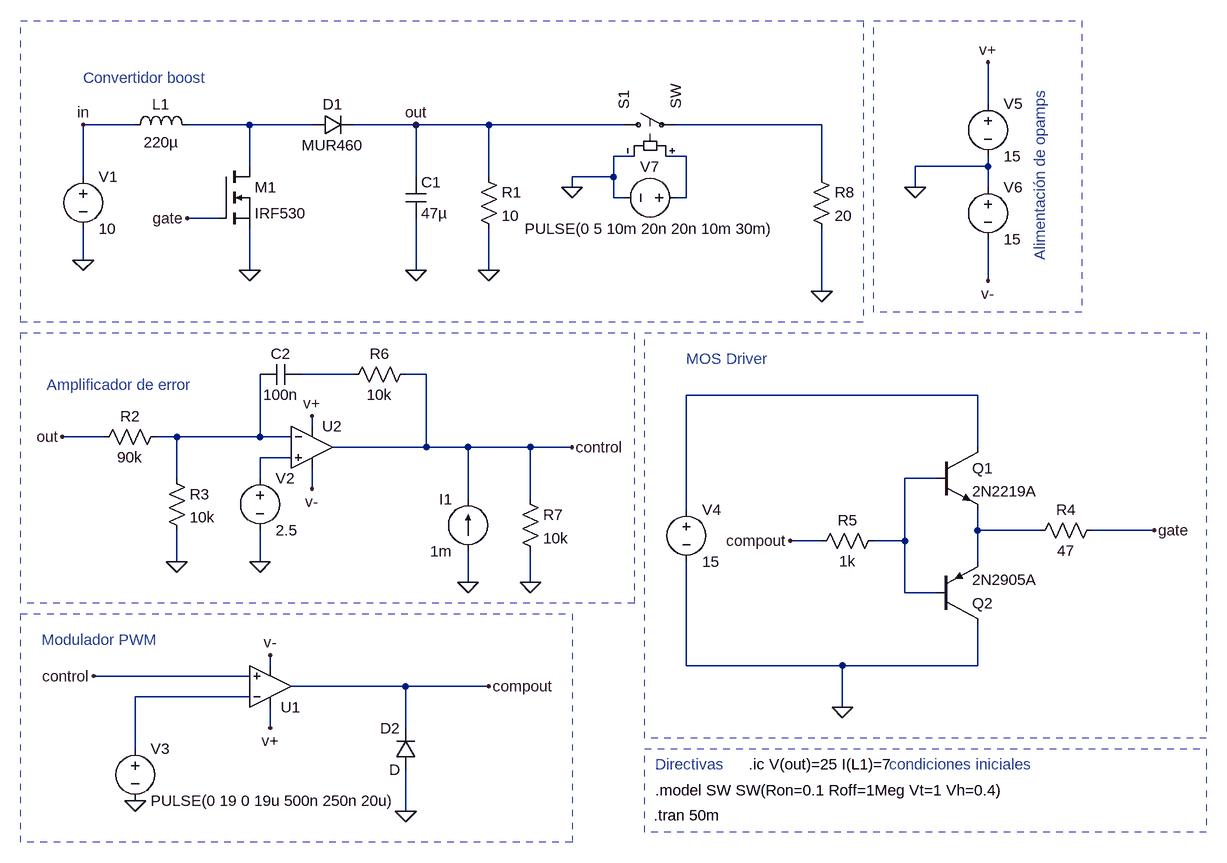
[diagram p0: schematic e4-tp2-ej1.asc]
e4-tp2-ej1.asc, the LTspice schematic file:
Version 4
SHEET 1 920 1444
WIRE 512 -384 512 -448
WIRE -800 -352 -880 -352
WIRE -624 -352 -720 -352
WIRE -528 -352 -624 -352
WIRE -368 -352 -464 -352
WIRE -256 -352 -368 -352
WIRE -48 -352 -256 -352
WIRE 256 -352 32 -352
WIRE -32 -304 -64 -304
WIRE 48 -304 16 -304
WIRE -624 -288 -624 -352
WIRE 512 -288 512 -304
WIRE 512 -288 400 -288
WIRE -880 -272 -880 -352
WIRE -368 -272 -368 -352
WIRE -256 -272 -256 -352
WIRE -64 -272 -64 -304
WIRE -64 -272 -128 -272
WIRE 256 -272 256 -352
WIRE -128 -256 -128 -272
WIRE 400 -256 400 -288
WIRE 512 -256 512 -288
WIRE -64 -240 -64 -272
WIRE -48 -240 -64 -240
WIRE 48 -240 48 -304
WIRE 48 -240 32 -240
WIRE -672 -208 -720 -208
WIRE -880 -144 -880 -192
WIRE -624 -128 -624 -192
WIRE -368 -128 -368 -208
WIRE -256 -128 -256 -192
WIRE 512 -112 512 -176
WIRE 256 -96 256 -192
WIRE -464 32 -544 32
WIRE -352 32 -384 32
WIRE 496 64 48 64
WIRE -528 112 -528 96
WIRE -848 128 -912 128
WIRE -736 128 -768 128
WIRE -608 128 -608 32
WIRE -608 128 -736 128
WIRE -560 128 -608 128
WIRE -352 144 -352 32
WIRE -352 144 -496 144
WIRE -288 144 -352 144
WIRE -192 144 -288 144
WIRE -128 144 -192 144
WIRE 496 144 496 64
WIRE -560 160 -608 160
WIRE -736 192 -736 128
WIRE -608 192 -608 160
WIRE 432 192 384 192
WIRE -528 208 -528 176
WIRE -288 224 -288 144
WIRE -192 224 -192 144
WIRE 48 240 48 64
WIRE 496 272 496 240
WIRE 592 272 496 272
WIRE 768 272 672 272
WIRE 256 288 208 288
WIRE 384 288 384 192
WIRE 384 288 336 288
WIRE -736 320 -736 272
WIRE -608 320 -608 272
WIRE 496 320 496 272
WIRE -288 352 -288 304
WIRE -192 352 -192 304
WIRE 384 368 384 288
WIRE 432 368 384 368
WIRE -592 480 -592 464
WIRE 48 480 48 320
WIRE 288 480 48 480
WIRE 496 480 496 416
WIRE 496 480 288 480
WIRE -624 496 -864 496
WIRE -384 512 -560 512
WIRE -256 512 -384 512
WIRE -624 528 -800 528
WIRE 288 544 288 480
WIRE -592 576 -592 544
WIRE -384 576 -384 512
WIRE -800 608 -800 528
WIRE -384 704 -384 640
FLAG -800 688 0
FLAG -880 -144 0
FLAG -368 -128 0
FLAG -256 -128 0
FLAG -368 -352 out
FLAG -880 -352 in
FLAG -912 128 out
FLAG -736 320 0
FLAG -608 320 0
FLAG -288 352 0
FLAG -192 352 0
FLAG -128 144 control
FLAG -624 -128 0
FLAG -720 -208 gate
FLAG -384 704 0
FLAG -864 496 control
FLAG -256 512 compout
FLAG 208 288 compout
FLAG 288 544 0
FLAG 768 272 gate
FLAG 256 -96 0
FLAG 400 -256 0
FLAG 512 -448 v+
FLAG 512 -112 v-
FLAG -592 464 v-
FLAG -528 208 v-
FLAG -528 96 v+
FLAG -592 576 v+
FLAG -128 -256 0
SYMBOL voltage -800 592 R0
WINDOW 123 0 0 Left 0
WINDOW 39 0 0 Left 0
SYMATTR InstName V3
SYMATTR Value PULSE(0 19 0 19u 500n 250n 20u)
SYMBOL voltage -880 -288 R0
WINDOW 123 0 0 Left 0
WINDOW 39 0 0 Left 0
SYMATTR InstName V1
SYMATTR Value 10
SYMBOL ind -816 -336 R270
WINDOW 0 32 56 VTop 2
WINDOW 3 5 56 VBottom 2
SYMATTR InstName L1
SYMATTR Value 220µ
SYMBOL cap -384 -272 R0
SYMATTR InstName C1
SYMATTR Value 47µ
SYMBOL nmos -672 -288 R0
SYMATTR InstName M1
SYMATTR Value IRF530
SYMBOL res -272 -288 R0
SYMATTR InstName R1
SYMATTR Value 10
SYMBOL sw -64 -352 R270
SYMATTR InstName S1
SYMBOL res -752 112 R90
WINDOW 0 0 56 VBottom 2
WINDOW 3 32 56 VTop 2
SYMATTR InstName R2
SYMATTR Value 90k
SYMBOL res -752 176 R0
SYMATTR InstName R3
SYMATTR Value 10k
SYMBOL voltage -608 176 R0
WINDOW 123 0 0 Left 0
WINDOW 39 0 0 Left 0
SYMATTR InstName V2
SYMATTR Value 2.5
SYMBOL res -368 16 R90
WINDOW 0 0 56 VBottom 2
WINDOW 3 32 56 VTop 2
SYMATTR InstName R6
SYMATTR Value 10k
SYMBOL cap -544 16 R90
WINDOW 0 0 32 VBottom 2
WINDOW 3 32 32 VTop 2
SYMATTR InstName C2
SYMATTR Value 100n
SYMBOL res -208 208 R0
SYMATTR InstName R7
SYMATTR Value 10k
SYMBOL current -288 304 R180
WINDOW 0 24 80 Left 2
WINDOW 3 24 0 Left 2
WINDOW 123 0 0 Left 0
WINDOW 39 0 0 Left 0
SYMATTR InstName I1
SYMATTR Value 1m
SYMBOL Opamps\\UniversalOpamp2 -528 144 R0
SYMATTR InstName U2
SYMBOL Opamps\\UniversalOpamp2 -592 512 M180
SYMATTR InstName U1
SYMBOL diode -368 640 R180
WINDOW 0 24 64 Left 2
WINDOW 3 24 0 Left 2
SYMATTR InstName D2
SYMBOL diode -528 -336 R270
WINDOW 0 32 32 VTop 2
WINDOW 3 0 32 VBottom 2
SYMATTR InstName D1
SYMATTR Value MUR460
SYMBOL res 688 256 R90
WINDOW 0 0 56 VBottom 2
WINDOW 3 32 56 VTop 2
SYMATTR InstName R4
SYMATTR Value 47
SYMBOL res 352 272 R90
WINDOW 0 0 56 VBottom 2
WINDOW 3 32 56 VTop 2
SYMATTR InstName R5
SYMATTR Value 1k
SYMBOL npn 432 144 R0
SYMATTR InstName Q1
SYMATTR Value 2N2219A
SYMBOL pnp 432 416 M180
SYMATTR InstName Q2
SYMATTR Value 2N2905A
SYMBOL voltage 48 224 R0
WINDOW 123 0 0 Left 0
WINDOW 39 0 0 Left 0
SYMATTR InstName V4
SYMATTR Value 15
SYMBOL voltage 512 -400 R0
WINDOW 123 0 0 Left 0
WINDOW 39 0 0 Left 0
SYMATTR InstName V5
SYMATTR Value 15
SYMBOL voltage 512 -272 R0
WINDOW 123 0 0 Left 0
WINDOW 39 0 0 Left 0
SYMATTR InstName V6
SYMATTR Value 15
SYMBOL voltage 48 -240 R90
WINDOW 0 -32 56 VBottom 2
WINDOW 3 32 56 VTop 2
WINDOW 123 0 0 Left 0
WINDOW 39 0 0 Left 0
SYMATTR InstName V7
SYMATTR Value PULSE(0 5 10m 20n 20n 10m 30m)
SYMBOL res 240 -288 R0
SYMATTR InstName R8
SYMATTR Value 20
TEXT -880 -424 Left 2 ;Convertidor boost
TEXT -936 48 Left 2 ;Amplificador de error
TEXT -944 440 Left 2 ;Modulador PWM
TEXT 592 -408 VRight 2 ;Alimentación de opamps
TEXT 48 8 Left 2 ;MOS Driver
TEXT -2 710 Left 2 !.tran 50m
TEXT 0 672 Left 2 !.model SW SW(Ron=0.1 Roff=1Meg Vt=1 Vh=0.4)
TEXT 0 632 Left 2 ;Directivas
TEXT 144 632 Left 2 !.ic V(out)=25 I(L1)=7
TEXT 360 632 Left 2 ;condiciones iniciales
RECTANGLE Normal 320 -48 -976 -512 2
RECTANGLE Normal -32 384 -976 -32 2
RECTANGLE Normal -128 752 -976 400 2
RECTANGLE Normal 656 -64 336 -512 2
RECTANGLE Normal 848 592 -16 -32 2
RECTANGLE Normal 848 736 -16 608 2

The netlist it stands for:
* e4-tp2-ej1.asc
V3 N010 0 PULSE(0 19 0 19u 500n 250n 20u)
V1 in 0 10
L1 in N001 220µ
C1 out 0 47µ
M1 N001 gate 0 0 IRF530
R1 out 0 10
S1 out N002 N003 0 SW
R2 N006 out 90k
R3 N006 0 10k
V2 N007 0 2.5
R6 control N004 10k
C2 N004 N006 100n
R7 control 0 10k
I1 0 control 1m
XU2 N007 N006 v+ v- control level.2 Avol=1Meg GBW=10Meg Slew=10Meg ilimit=25m rail=0 Vos=0 phimargin=45 en=0 enk=0 in=0 ink=0 Rin=500Meg  ; pins IN+ IN- V+ V- OUT
XU1 control N010 v+ v- compout level.2 Avol=1Meg GBW=10Meg Slew=10Meg ilimit=25m rail=0 Vos=0 phimargin=45 en=0 enk=0 in=0 ink=0 Rin=500Meg  ; pins IN+ IN- V+ V- OUT
D2 0 compout D
D1 N001 out MUR460
R4 gate N009 47
R5 N008 compout 1k
Q1 N005 N008 N009 0 2N2219A
Q2 0 N008 N009 0 2N2905A
V4 N005 0 15
V5 v+ 0 15
V6 0 v- 15
V7 N003 0 PULSE(0 5 10m 20n 20n 10m 30m)
R8 N002 0 20
.model D D
.lib standard.dio
.model NPN NPN
.model PNP PNP
.lib standard.bjt
.model NMOS NMOS
.model PMOS PMOS
.lib standard.mos
* Convertidor boost
* Amplificador de error
* Modulador PWM
* Alimentación de opamps
* MOS Driver
.tran 50m
.model SW SW(Ron=0.1 Roff=1Meg Vt=1 Vh=0.4)
* Directivas
.ic V(out)=25 I(L1)=7
* condiciones iniciales
.lib UniversalOpamps2.sub
.backanno
.end